# Altium schematic sheet RFID Reader IO.SchDoc
size A3; SheetNumber: 4; SheetTotal: 8
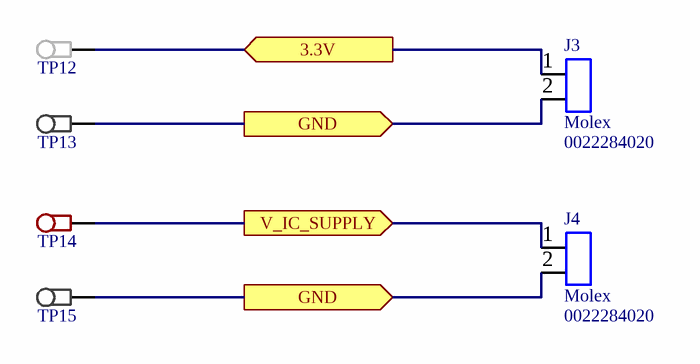
[diagram p0: RFID Reader IO.SchDoc]

## Parts
?  (no value)  (graphical)
J3  Manufacturer: Molex  [0022284020]  (hidden comment: 0022284020)
J4  Manufacturer: Molex  [0022284020]  (hidden comment: 0022284020)
TP12  5002  [5002]  (value not drawn)
TP13  5001  [5001]  (value not drawn)
TP14  5000  [5000]  (value not drawn)
TP15  5001  [5001]  (value not drawn)

## Ports
3.3V (in), GND (out), V_IC_SUPPLY (out)

## Nets
3.3V: J3.1 TP12.1 ; port 3.3V
GND: J3.2 J4.2 TP13.1 TP15.1 ; port GND
V_IC_SUPPLY: J4.1 TP14.1 ; port V_IC_SUPPLY

## Notes on the sheet
- LAYER NAME
- CRITICAL QUALITY ATTRIBUTE
- TITLE NAME
- THIS DRAWING CONTAINS CONFIDENTIAL INFORMATION AND IS ISSUED IN CONFIDENCE ON THE CONDITIONS
  THAT IT BE RETURNED ON DEMAND AND NOT BE COPIED, REPRODUCED, DISCLOSED TO OTHERS OR USED
  IN THE MANUFACTURE OF THE SUBJECT-MATTER THEREOF WITHOUT THE WRITTEN CONSENT OF
  STRYKER CORPORATION.
- SHALL BE COMPLIANT PER ES-1168 AND ES-1005
- SHEET
- OF
- NUMBER
- REV
- APPROVALS ARE FOUND IN PLM SYSTEM

## Library data of the parts
? = CMP-001-0000-v0.01.17: Stryker standard title block with pre-parameterized fields
J3 J4 = CMP-00014-v0.01.04: Board Connector, 2 Contact(s), 1 Row(s), Male, Straight, Solder Terminal; Manufacturer Series: 42375; MIL Conformance: No; Style Guide Revision: Librarian to Review; Contact Current Rating - Max: 4A; Device Length: 5.08mm; Material Flammability Rating: 94V-0; Device Width: 2.49mm; Pitch - Mating: 2.54mm; Connector Style: Other; Voltage Rating: 500V; Rows: 1; Connector Type: Header; Device Height: 7.75mm; Mating Connector: multiple; Option: General Purpose; Contact Material: Brass; Mount: Board; System: Connector; Contact Finish - Mating: Tin; RoHS Compliant: Yes; IEC Conformance: No; Mounting Technology: PTH; Insulation Color: Black; Orientation: Vertical; Critical Component: -; Insulation Material: High Temperature Thermoplastic; Mixed Contacts: No; DIN Conformance: No; Gender: Male; JESD-609 Code: e3; Contact Finish - Termination: Tin (Sn) - with Nickel (Ni) barrier; Contact Finish - Mounting: Tin; Filter Feature: No; Manufacturer Part Number: 0022284020; Operating Temperature - Min: -40°C; Contact Finish Thickness - Mating: 2.54µm; Features: Breakaway; Contact Gender: Male; REACH Compliant: Unaffected; Pins: 2; Operating Temperature - Max: 80°C; Termination: Solder; Terminal Pitch: 2.54mm
TP12 = CMP-000021-v0.01.01: TEST POINT, PCB, THROUGH HOLE; Product R; Range: -; Connector Colour: White; Mounting: Through Hole; Manufacturer Series: THM; Manufacturer: Keystone; Device Height Above Board: 4.6mm; Device Length: 2.5mm; Material - Body: 1; Outside Diameter: 2.54mm; Device Height: 7.6mm; Hole Diameter: 1mm; Body Material: Bronze; Material - Insulation: Nylon; Test Point Signal Structure: Single Ended; Test Point Is Used: X; Plating: Silver; Pin Count: 1; Moisture Sensitivity Level: 1; Manufacturer Part Number: 5002; Mounting Technology: PTH; Operating Temperature - Min: -999°C; Operating Temperature - Max: 999°C; Device Width: 2.5mm; ComponentLink1Description: Manufacturer Product Page; Critical Component: -; ComponentLink1URL: https://www.keyelco.com/product.cfm/product_id/1311; REACH Compliance: Yes; RoHS Compliance: Yes; Color: White
TP13 TP15 = CMP-001-0099-v0.01.02: TEST POINT, PCB, THROUGH HOLE; Product R; Range: -; Connector Colour: Black; Mounting: Through Hole; Manufacturer: Keystone; Manufacturer Series: THM; Device Height Above Board: 4.6mm; Device Width: 2.5mm; Body Material: Bronze; Material - Insulation: Nylon; Hole Diameter: 1mm; Device Height: 7.6mm; Test Point Signal Structure: Single Ended; Test Point Is Used: X; Material - Body: 1; Plating: Silver; Outside Diameter: 2.54mm; REACH Compliance: Yes; Color: Black; ComponentLink1Description: Manufacturer Product Page; Moisture Sensitivity Level: 1; Mounting Technology: PTH; Pin Count: 1; Device Length: 2.5mm; Operating Temperature - Max: 999°C; Critical Component: -; Manufacturer Part Number: 5001; RoHS Compliance: Yes; ComponentLink1URL: https://www.keyelco.com/product.cfm/product_id/1310; Operating Temperature - Min: -999°C
TP14 = CMP-000022-v0.01.00: TEST POINT, PCB, THROUGH HOLE; Product R; Range: -; Connector Colour: Red; Mounting: Through Hole; Manufacturer: Keystone; Manufacturer Series: THM; Plating: Silver; Device Width: 2.5mm; Device Height: 7.6mm; Outside Diameter: 2.54mm; Test Point Is Used: X; Test Point Signal Structure: Single Ended; Material - Insulation: Nylon; Body Material: Bronze; Device Height Above Board: 4.6mm; Material - Body: 1; Hole Diameter: 1mm; Mounting Technology: PTH; RoHS Compliance: Yes; Moisture Sensitivity Level: 1; Critical Component: -; Operating Temperature - Min: -999°C; REACH Compliance: Yes; ComponentLink1Description: Manufacturer Product Page; Pin Count: 1; Device Length: 2.5mm; Color: Red; Manufacturer Part Number: 5000; Operating Temperature - Max: 999°C; ComponentLink1URL: https://www.keyelco.com/product.cfm/product_id/1309